# Altium project OneFader_Main.PrjPcb
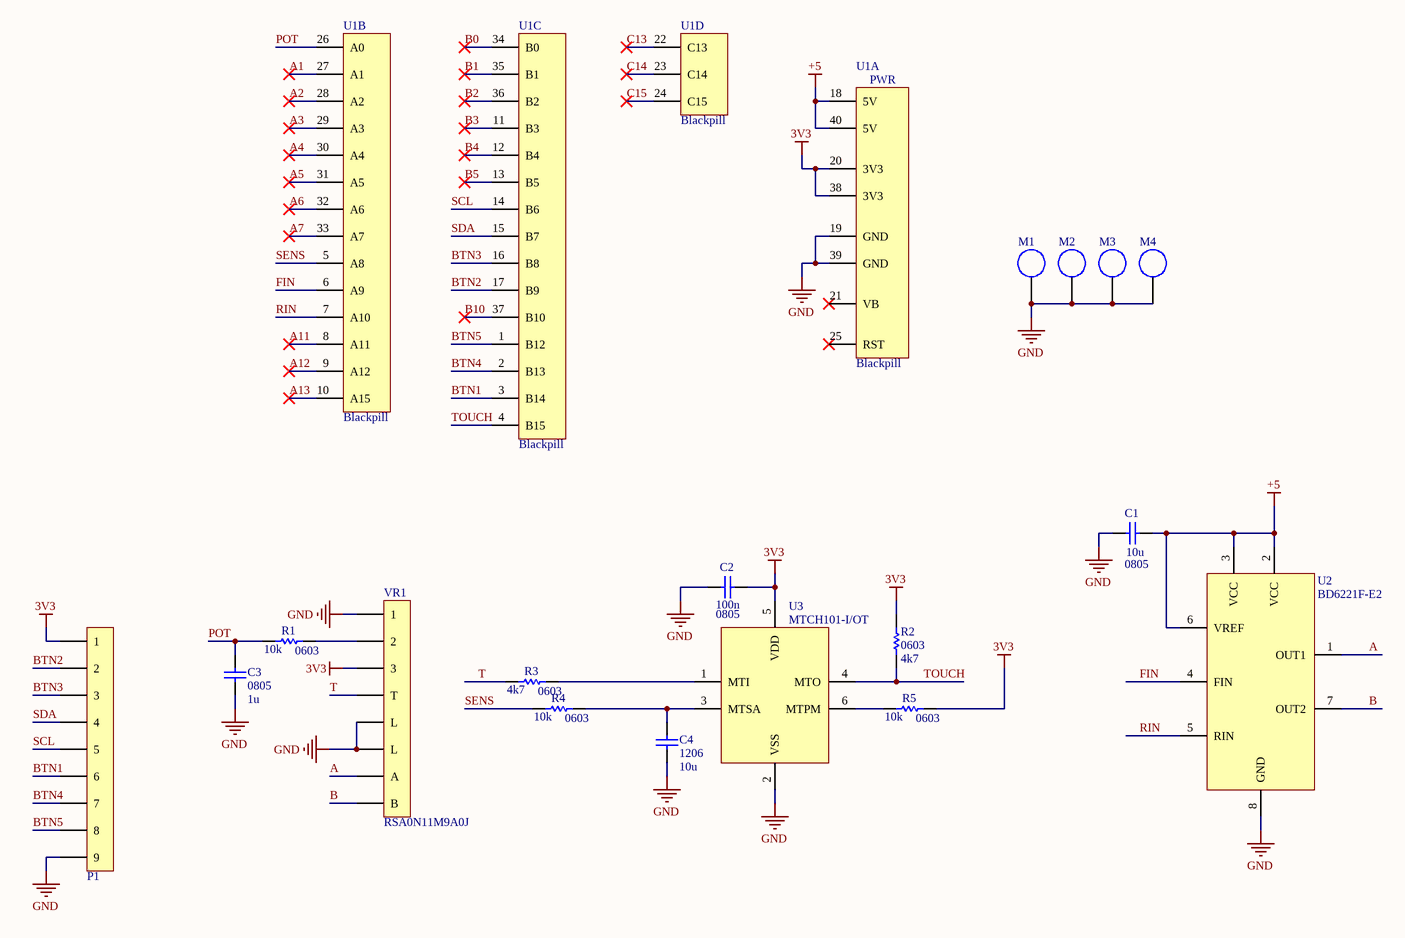
[diagram p0: TopLevel.SchDoc]
MainCompanyName: Electric Canary; MainEngineer: Antoine Ricoux; MainRevision: A; ProjectTitle: OneFader
1 sheet, 18 parts. Net scope: global (net labels, ports and power ports of the same name join across sheets).
Board file: OneFader_Main.PcbDoc

## Sheet TopLevel.SchDoc: Main Board
size A3; CompanyName: Electric Canary; Engineer: Antoine Ricoux; Revision: A; SheetNumber: 1; SheetTotal: 1; SheetTitle: Main Board

### Parts
C1  value 10u  Package: 0805  [CAPC2012X14N]  (hidden comment: C_NP_0805_Generic)
C2  value 100n  Package: 0805  [CAPC2012X14N]  (hidden comment: C_NP_0805_Generic)
C3  value 1u  Package: 0805  [CAPC2012X14N]  (hidden comment: C_NP_0805_Generic)
C4  value 10u  Package: 1206  [CAPC3216X14N]  (hidden comment: C_NP_1206_Generic)
M1  M3 Flat Screw  [M3 Screw]  (value not drawn)
M2  M3 Flat Screw  [M3 Screw]  (value not drawn)
M3  M3 Flat Screw  [M3 Screw]  (value not drawn)
M4  M3 Flat Screw  [M3 Screw]  (value not drawn)
P1  9 Header  [9 Header]  (value not drawn)
R1  value 10k  Package: 0603  [RESC1608X06N]  (hidden comment: R_0603_Generic)
R2  value 4k7  Package: 0603  [RESC1608X06N]  (hidden comment: R_0603_Generic)
R3  value 4k7  Package: 0603  [RESC1608X06N]  (hidden comment: R_0603_Generic)
R4  value 10k  Package: 0603  [RESC1608X06N]  (hidden comment: R_0603_Generic)
R5  value 10k  Package: 0603  [RESC1608X06N]  (hidden comment: R_0603_Generic)
U1  Blackpill  [BlackPill - WeAct]  (parts A,B,C,D of 4)
U2  BD6221F-E2  [SOP127P620X160-8N]
U3  MTCH101-I/OT  [SOT95P270X145-6N]
VR1  RSA0N11M9A0J  [RSA0N11M9A0J]

### Nets
3V3: C2.2 P1.1 R2.2 R5.2 U1.20(3V3) U1.38(3V3) U3.5(VDD) VR1.3
+5: C1.2 U1.18(5V) U1.40(5V) U2.2(VCC) U2.3(VCC) U2.6(VREF)
GND: C1.1 C2.1 C3.1 C4.1 M1.1 M2.1 M3.1 M4.1 P1.9 U1.19(GND) U1.39(GND) U2.8(GND) U3.2(VSS) VR1.1 VR1.L1(L) VR1.L2(L)
A: U2.1(OUT1) VR1.A
A1: U1.27(A1)
A2: U1.28(A2)
A3: U1.29(A3)
A4: U1.30(A4)
A5: U1.31(A5)
A6: U1.32(A6)
A7: U1.33(A7)
A11: U1.8(A11)
A12: U1.9(A12)
A13: U1.10(A15)
B: U2.7(OUT2) VR1.B
B0: U1.34(B0)
B1: U1.35(B1)
B2: U1.36(B2)
B3: U1.11(B3)
B4: U1.12(B4)
B5: U1.13(B5)
B10: U1.37(B10)
BTN1: P1.6 U1.3(B14)
BTN2: P1.2 U1.17(B9)
BTN3: P1.3 U1.16(B8)
BTN4: P1.7 U1.2(B13)
BTN5: P1.8 U1.1(B12)
C13: U1.22(C13)
C14: U1.23(C14)
C15: U1.24(C15)
FIN: U1.6(A9) U2.4(FIN)
POT: C3.2 R1.1 U1.26(A0)
RIN: U1.7(A10) U2.5(RIN)
SCL: P1.5 U1.14(B6)
SDA: P1.4 U1.15(B7)
SENS: R4.1 U1.5(A8)
T: R3.1 VR1.T
TOUCH: R2.1 U1.4(B15) U3.4(MTO)
NetC4_2: C4.2 R4.2 U3.3(MTSA)
NetR1_2: R1.2 VR1.2
NetR3_2: R3.2 U3.1(MTI)
NetR5_1: R5.1 U3.6(MTPM)

Not connected (* = marked no-connect by the designer): U1 21(VB)* 25(RST)*

### Notes on the sheet
- Size:
- A3
- Variant:
- Revision:
- Drawn By:
- File:
- Date:
- Time:
- Sheet
- of
- AW Audio
- (in symbol Black Pill - We Act, part A) PWR

### Library data of the parts
C1-C3 = C0-STD-0008-2: Generic 0805 Non Polarized Capacitor; Manufacturer: Generic; Sub-Category: C; Category: Passive
C4 = C0-STD-0009-3: Generic 1206 Non Polarized Capacitor; Category: Passive; Manufacturer: Generic; Sub-Category: C
R1-R5 = C0-STD-0006-8: Generic 0603 Resistor; Sub-Category: R; Category: Passive; Manufacturer: Generic
U1 = Black Pill - We Act
U2 = BD6221F-E2: DC Brush Motor Driver, 6 to 18 V, 1 A, -40 to 85 degC, 8-Pin SOP, RoHS, Tape and Reel; Manufacturer: ROHM Semiconductor; Supply Voltage: 6 to 15 V; RON@IOUT: 0.5 A=1.5 Ohm Typ.; Output Current: 1 A Max.; ComponentLink1URL: http://www.rohm.com/web/global/; Mounting Technology: Surface Mount; DatasheetVersion: Rev. 003; ComponentLink2Description: Datasheet; RoHS: TRUE; ComponentLink3URL: http://rohmfs.rohm.com/en/products/databook/package/spec/ic/sop-1-2-e.pdf; ComponentLink1Description: Manufacturer URL; PartNumber: BD6221F-E2; PackageDescription: 8-Pin Small Outline Package, Body 5 x 4.4 mm, Pitch 1.27 mm; ComponentLink3Description: Package Specification; ComponentLink2URL: http://rohmfs.rohm.com/en/products/databook/datasheet/ic/motor/dc/bd622x-e.pdf; Temperature Range: -40 to 85 degC; PackageVersion: Rev. A; Packing: Tape and Reel
U3 = MTCH101-I/OT: Single Channel Proximity Detector 6-Pin SOT-23 T/R
VR1 = RSA0N11M9A0J: Motorized 10k Linear Fader

## Assembly variants
Main: all parts fitted